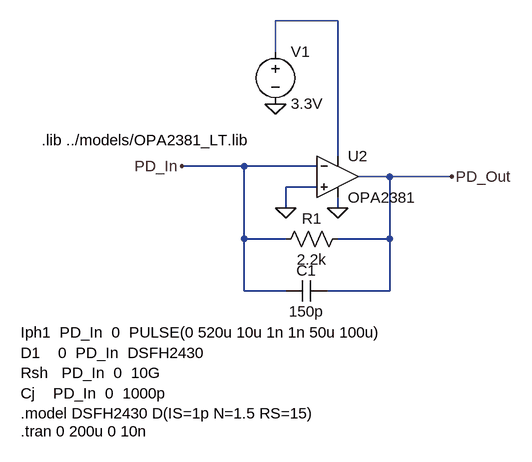
[diagram p0: schematic PD_amplifier.asc]
PD_amplifier.asc, the LTspice schematic file:
Version 4.1
SHEET 1 940 936
WIRE 656 288 560 288
WIRE 560 336 560 288
WIRE 656 496 656 288
WIRE 512 512 416 512
WIRE 624 512 512 512
WIRE 736 528 688 528
WIRE 832 528 736 528
WIRE 624 544 576 544
WIRE 576 576 576 544
WIRE 656 576 656 560
WIRE 512 624 512 512
WIRE 576 624 512 624
WIRE 736 624 736 528
WIRE 736 624 656 624
WIRE 512 704 512 624
WIRE 576 704 512 704
WIRE 736 704 736 624
WIRE 736 704 640 704
FLAG 656 576 0
FLAG 560 416 0
FLAG 576 576 0
FLAG 416 512 PD_In
FLAG 832 528 PD_Out
SYMBOL OPA2381 656 464 R0
SYMATTR InstName U2
SYMATTR Value OPA2381
SYMBOL voltage 560 320 R0
SYMATTR InstName V1
SYMATTR Value 3.3V
SYMBOL res 672 608 R90
WINDOW 0 0 56 VBottom 2
WINDOW 3 32 56 VTop 2
SYMATTR InstName R1
SYMATTR Value 2.2k
SYMBOL cap 640 688 R90
WINDOW 0 0 32 VBottom 2
WINDOW 3 32 32 VTop 2
SYMATTR InstName C1
SYMATTR Value 150p
TEXT 200 472 Left 2 !.lib ../models/OPA2381_LT.lib
TEXT 168 768 Left 2 !Iph1  PD_In  0  PULSE(0 520u 10u 1n 1n 50u 100u)\nD1    0  PD_In  DSFH2430\nRsh   PD_In  0  10G\nCj    PD_In  0  1000p\n.model DSFH2430 D(IS=1p N=1.5 RS=15)
TEXT 168 920 Left 2 !.tran 0 200u 0 10n

The netlist it stands for:
* PD_amplifier.asc
* U2: OPA2381 (symbol OPA2381 not available, pins judged from their places): In+=0 In-=PD_In V+=N001 V-=0 OUT=PD_Out
V1 N001 0 3.3V
R1 PD_Out PD_In 2.2k
C1 PD_Out PD_In 150p
.lib ../models/OPA2381_LT.lib
Iph1  PD_In  0  PULSE(0 520u 10u 1n 1n 50u 100u)
D1    0  PD_In  DSFH2430
Rsh   PD_In  0  10G
Cj    PD_In  0  1000p
.model DSFH2430 D(IS=1p N=1.5 RS=15)
.tran 0 200u 0 10n
.backanno
.end